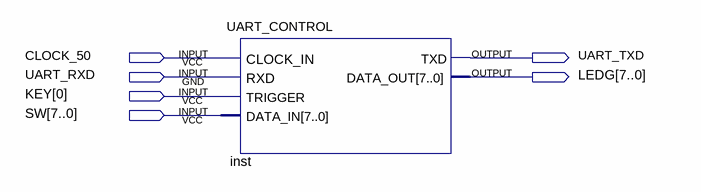
[diagram p0: schematic sheet]
// Quartus schematic UART.bdf as structural Verilog: 1 symbols, 6 pins
module UART (
  input  CLOCK_50,
  input  UART_RXD,
  input  [0:0] KEY,
  input  [7:0] SW,
  output UART_TXD,
  output [7:0] LEDG
);

  UART_CONTROL inst (
    .CLOCK_IN(CLOCK_50), .RXD(UART_RXD), .TRIGGER(KEY[0]), .DATA_IN(SW), .TXD(UART_TXD), .DATA_OUT(LEDG));
endmodule
